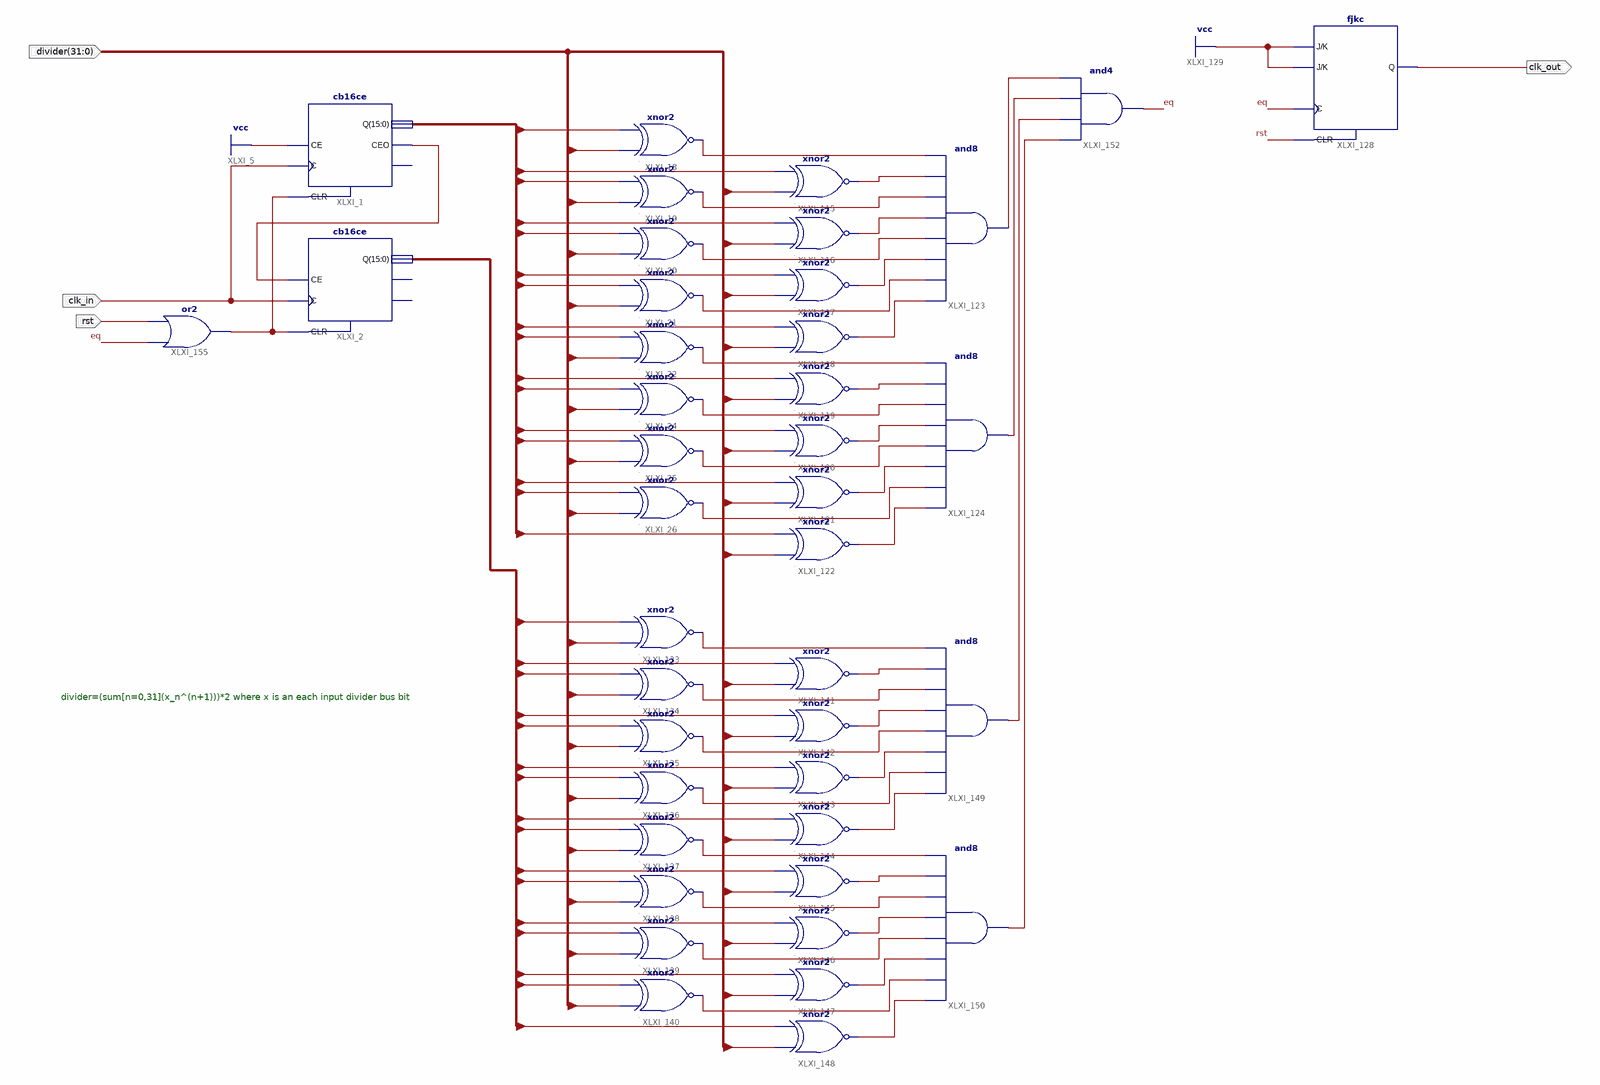
[diagram p0: schematic sheet 1]
// Xilinx ISE schematic freq_divider.sch (aspartan6) as structural Verilog: 41 symbols, 4 ports
module freq_divider (
  input  clk_in,
  input  rst,
  input  [31:0] divider,
  output clk_out
);

  wire clr, eq, XLXN_2, XLXN_55, XLXN_56, XLXN_57, XLXN_58, XLXN_59, XLXN_60, XLXN_61, XLXN_62, XLXN_63,
       XLXN_64, XLXN_65, XLXN_66, XLXN_67, XLXN_68, XLXN_69, XLXN_70, XLXN_82, XLXN_83, XLXN_122, XLXN_123,
       XLXN_124, XLXN_125, XLXN_126, XLXN_128, XLXN_129, XLXN_130, XLXN_132, XLXN_134, XLXN_136, XLXN_137,
       XLXN_138, XLXN_139, XLXN_141, XLXN_142, XLXN_160, XLXN_161;
  wire [15:0] cnt_1, cnt_2;

  cb16ce XLXI_2 (.C(clk_in), .CE(XLXN_2), .CLR(clr), .Q(cnt_2));  // open: CEO, TC
  cb16ce XLXI_1 (.C(clk_in), .CE(1'b1), .CLR(clr), .CEO(XLXN_2), .Q(cnt_1));  // open: TC
  xnor XLXI_18 (XLXN_70, divider[0], cnt_1[0]);
  xnor XLXI_19 (XLXN_55, divider[2], cnt_1[2]);
  xnor XLXI_20 (XLXN_58, divider[4], cnt_1[4]);
  xnor XLXI_21 (XLXN_65, divider[6], cnt_1[6]);
  xnor XLXI_22 (XLXN_66, divider[8], cnt_1[8]);
  xnor XLXI_24 (XLXN_67, divider[10], cnt_1[10]);
  xnor XLXI_25 (XLXN_68, divider[12], cnt_1[12]);
  xnor XLXI_26 (XLXN_69, divider[14], cnt_1[14]);
  xnor XLXI_115 (XLXN_56, divider[1], cnt_1[1]);
  xnor XLXI_116 (XLXN_57, divider[3], cnt_1[3]);
  xnor XLXI_117 (XLXN_59, divider[5], cnt_1[5]);
  xnor XLXI_118 (XLXN_60, divider[7], cnt_1[7]);
  xnor XLXI_119 (XLXN_61, divider[9], cnt_1[9]);
  xnor XLXI_120 (XLXN_62, divider[11], cnt_1[11]);
  xnor XLXI_121 (XLXN_63, divider[13], cnt_1[13]);
  xnor XLXI_122 (XLXN_64, divider[15], cnt_1[15]);
  and XLXI_123 (XLXN_82, XLXN_60, XLXN_65, XLXN_59, XLXN_58, XLXN_57, XLXN_55, XLXN_56, XLXN_70);
  and XLXI_124 (XLXN_83, XLXN_64, XLXN_69, XLXN_63, XLXN_68, XLXN_62, XLXN_67, XLXN_61, XLXN_66);
  xnor XLXI_133 (XLXN_142, divider[16], cnt_2[0]);
  xnor XLXI_134 (XLXN_122, divider[18], cnt_2[2]);
  xnor XLXI_135 (XLXN_125, divider[20], cnt_2[4]);
  xnor XLXI_136 (XLXN_136, divider[22], cnt_2[6]);
  xnor XLXI_137 (XLXN_137, divider[24], cnt_2[8]);
  xnor XLXI_138 (XLXN_138, divider[26], cnt_2[10]);
  xnor XLXI_139 (XLXN_139, divider[28], cnt_2[12]);
  xnor XLXI_140 (XLXN_141, divider[30], cnt_2[14]);
  xnor XLXI_141 (XLXN_123, divider[17], cnt_2[1]);
  xnor XLXI_142 (XLXN_124, divider[19], cnt_2[3]);
  xnor XLXI_143 (XLXN_126, divider[21], cnt_2[5]);
  xnor XLXI_144 (XLXN_128, divider[23], cnt_2[7]);
  xnor XLXI_145 (XLXN_129, divider[25], cnt_2[9]);
  xnor XLXI_146 (XLXN_130, divider[27], cnt_2[11]);
  xnor XLXI_147 (XLXN_132, divider[29], cnt_2[13]);
  xnor XLXI_148 (XLXN_134, divider[31], cnt_2[15]);
  and XLXI_149 (XLXN_160, XLXN_128, XLXN_136, XLXN_126, XLXN_125, XLXN_124, XLXN_122, XLXN_123, XLXN_142);
  and XLXI_150 (XLXN_161, XLXN_134, XLXN_141, XLXN_132, XLXN_139, XLXN_130, XLXN_138, XLXN_129, XLXN_137);
  and XLXI_152 (eq, XLXN_161, XLXN_160, XLXN_83, XLXN_82);
  fjkc XLXI_128 (.C(eq), .CLR(rst), .J(1'b1), .K(1'b1), .Q(clk_out));
  or XLXI_155 (clr, eq, rst);

  // Notes on the sheet:
  //   divider=(sum[n=0,31](x_n^(n+1)))*2 where x is an each input divider bus bit
endmodule
